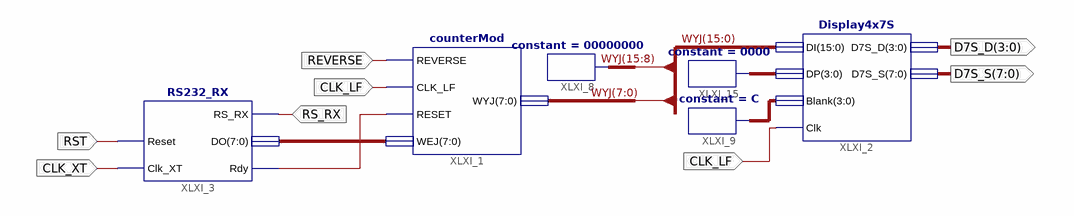
[diagram p0: schematic sheet 1]
// Xilinx ISE schematic scheme_counter.sch (xc9500xl) as structural Verilog: 6 symbols, 7 ports
module scheme_counter (
  input  CLK_LF,
  input  REVERSE,
  input  CLK_XT,
  input  RST,
  input  RS_RX,
  output [3:0] D7S_D,
  output [7:0] D7S_S
);

  wire RESET;
  wire [3:0] XLXN_9, XLXN_48;
  wire [7:0] XLXN_1;
  wire [15:0] WYJ;

  Display4x7S XLXI_2 (.DI(WYJ), .D7S_D(D7S_D), .D7S_S(D7S_S), .DP(XLXN_48), .Clk(CLK_LF), .Blank(XLXN_9));
  constant #(.CValue("C")) XLXI_9 (.O(XLXN_9));
  constant #(.CValue("00000000")) XLXI_8 (.O(WYJ[15:8]));
  counterMod XLXI_1 (.REVERSE(REVERSE), .CLK_LF(CLK_LF), .RESET(RESET), .WEJ(XLXN_1), .WYJ(WYJ[7:0]));
  RS232_RX XLXI_3 (.Reset(RST), .Clk_XT(CLK_XT), .Rdy(RESET), .DO(XLXN_1), .RS_RX(RS_RX));
  constant #(.CValue("0000")) XLXI_15 (.O(XLXN_48));
endmodule
